# Altium schematic sheet Emisor U.SchDoc
size A4
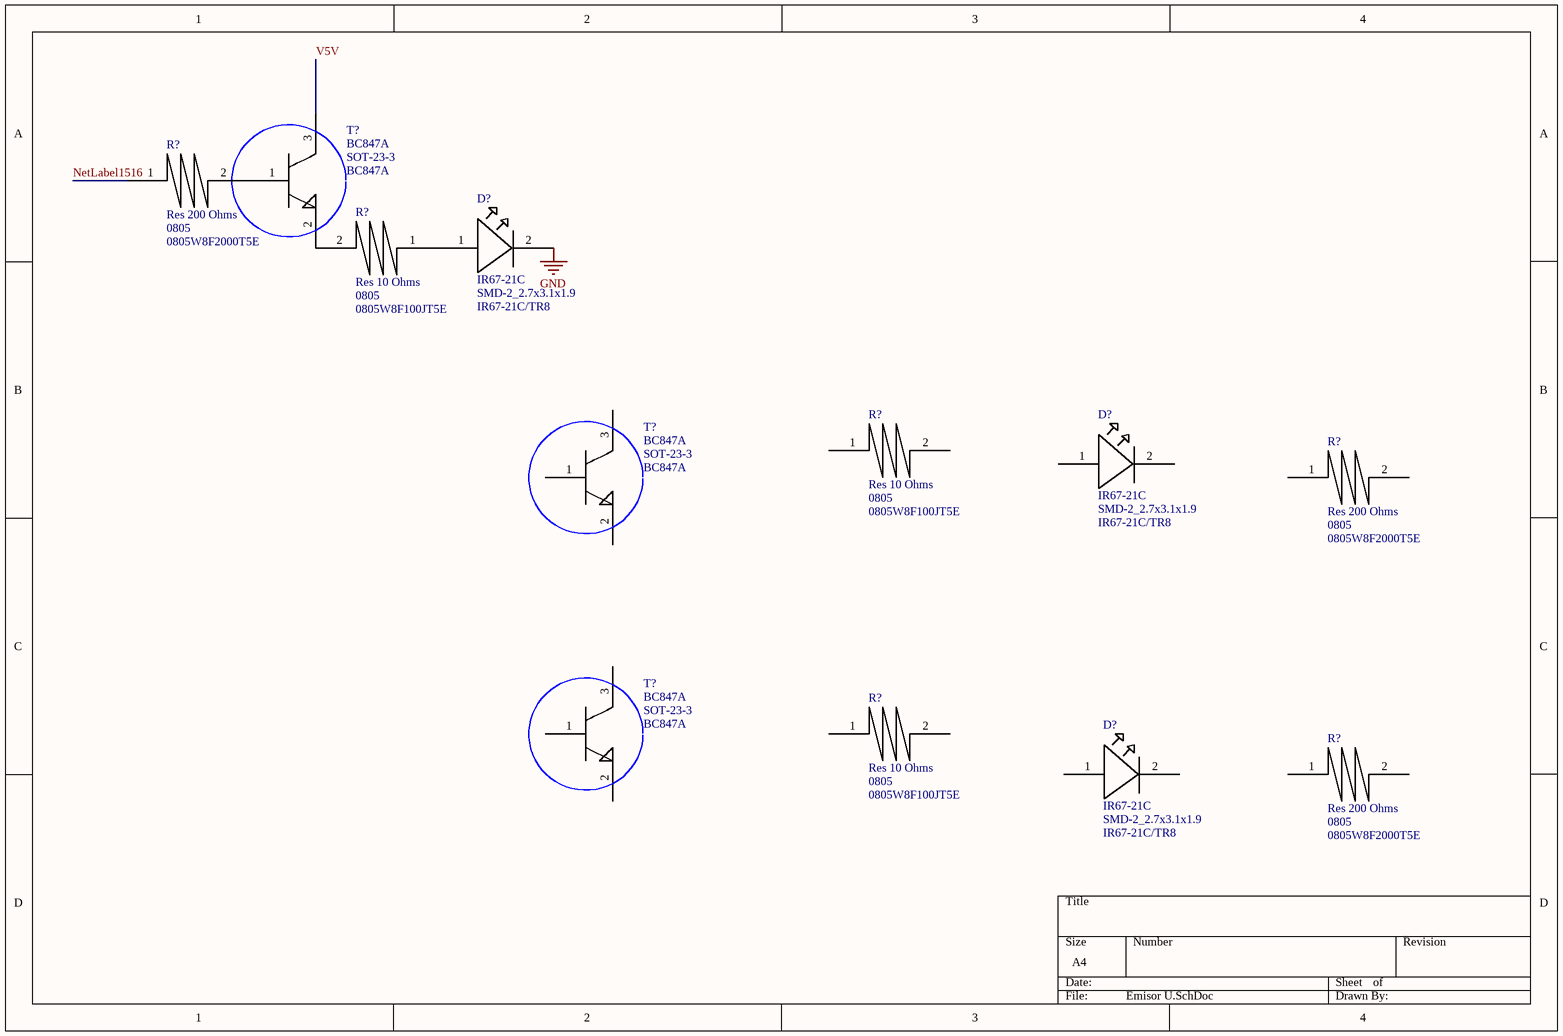
[diagram p0: Emisor U.SchDoc]

## Parts
(Parts that share a designator on the sheet are numbered #1, #2 ... from top to bottom, then left to right.)
D?#1  IR67-21C  Package: SMD-2_2.7x3.1x1.9  MFR.Part: IR67-21C/TR8  [IR67-21C]
D?#2  IR67-21C  Package: SMD-2_2.7x3.1x1.9  MFR.Part: IR67-21C/TR8  [IR67-21C]
D?#3  IR67-21C  Package: SMD-2_2.7x3.1x1.9  MFR.Part: IR67-21C/TR8  [IR67-21C]
R?#1  Res 200 Ohms  Package: 0805  MFR.Part #: 0805W8F2000T5E  [RES 200 OHMS]
R?#2  Res 10 Ohms  Package: 0805  MFR.Part #: 0805W8F100JT5E  [RES 10 OHMS]
R?#3  Res 10 Ohms  Package: 0805  MFR.Part #: 0805W8F100JT5E  [RES 10 OHMS]
R?#4  Res 200 Ohms  Package: 0805  MFR.Part #: 0805W8F2000T5E  [RES 200 OHMS]
R?#5  Res 10 Ohms  Package: 0805  MFR.Part #: 0805W8F100JT5E  [RES 10 OHMS]
R?#6  Res 200 Ohms  Package: 0805  MFR.Part #: 0805W8F2000T5E  [RES 200 OHMS]
T?#1  BC847A  Package: SOT-23-3  [BC847A]
T?#2  BC847A  Package: SOT-23-3  [BC847A]
T?#3  BC847A  Package: SOT-23-3  [BC847A]

## Nets
GND: D?#1.2
NetLabel1516: R?#1.1
V5V: T?#1.3
NetD?#1_1: D?#1.1 R?#2.1
NetR?#1_2: R?#1.2 T?#1.1
NetR?#2_2: R?#2.2 T?#1.2

Not connected (* = marked no-connect by the designer): D?#2 1 2; D?#3 1 2; R?#3 1 2; R?#4 1 2; R?#5 1 2; R?#6 1 2; T?#2 1 2 3; T?#3 1 2 3

## Library data of the parts
R?#1 R?#4 R?#6 = Res 200 Ohms: 200 Ohms
R?#2 R?#3 R?#5 = Res 10 Ohms smd
T?#1-T?#3 = BC847A: MFR.Part #: BC847A